# Altium project Hexapodik.PrjPcb
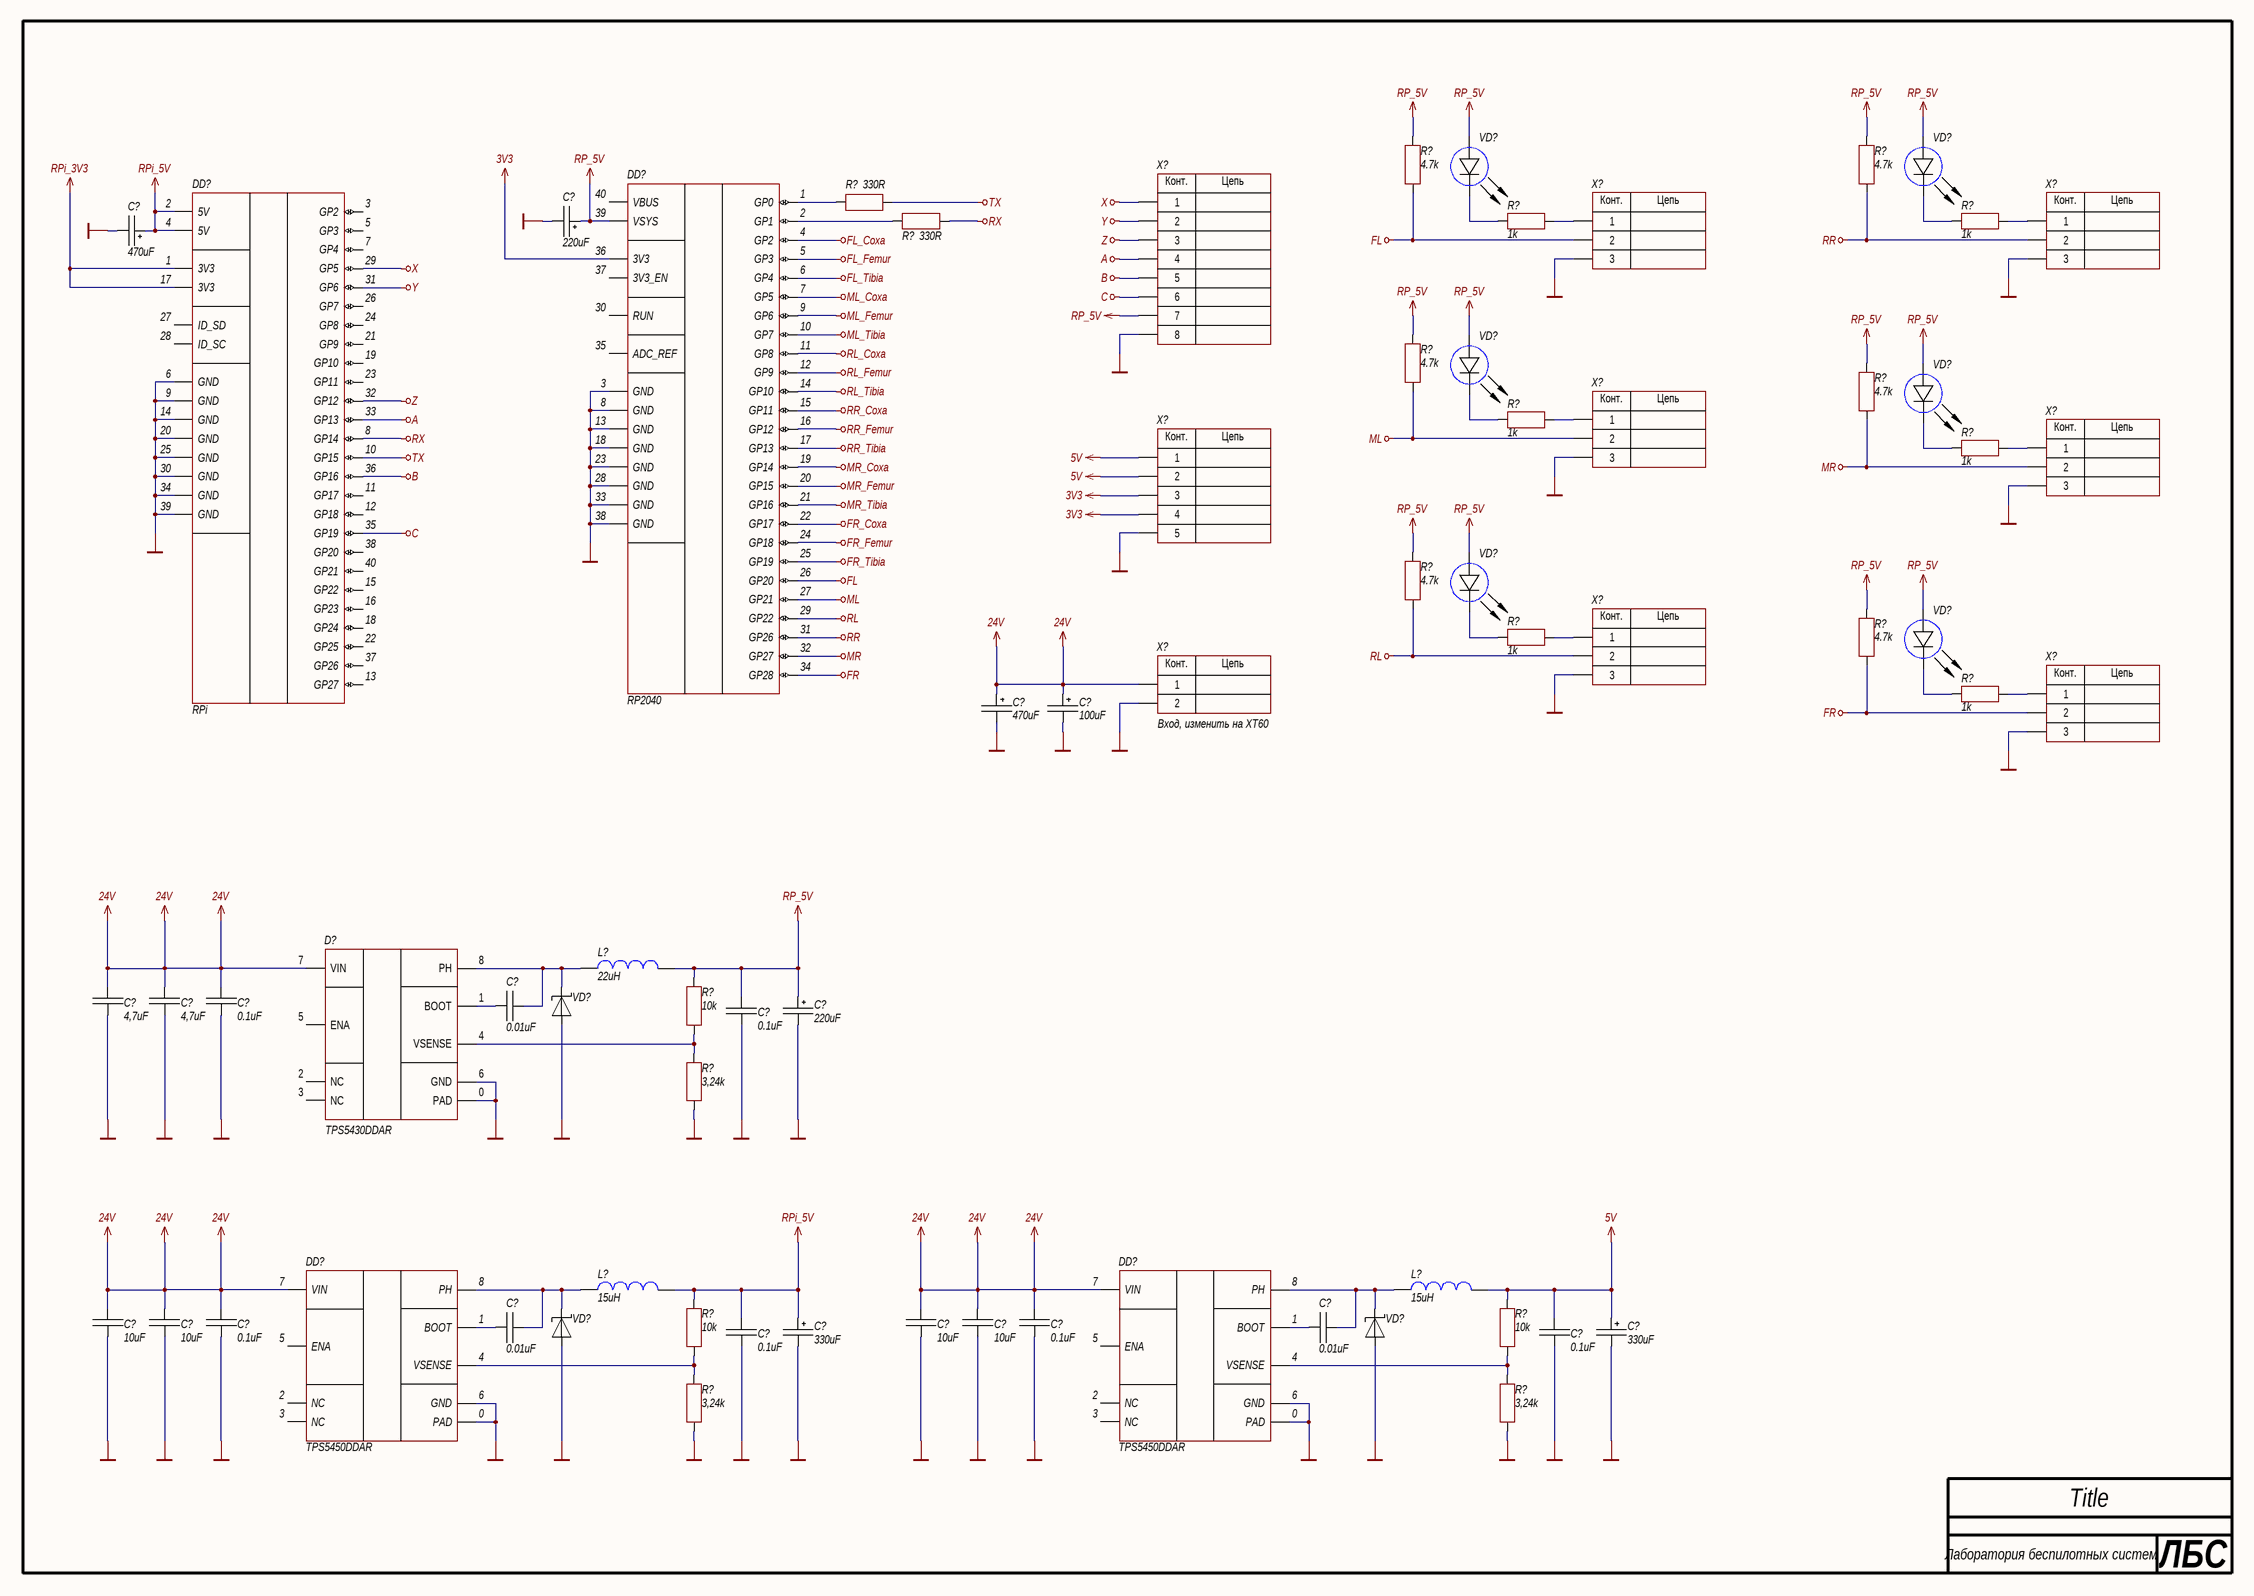
[diagram p0: Hexa.SchDoc]
2 sheets, 176 parts. Net scope: global (net labels, ports and power ports of the same name join across sheets).
Sheets:
  Hexa.SchDoc
  PowerLegs.SchDoc

## Sheet Hexa.SchDoc: Title
size 594 x 420 mm; CompanyName: Лаборатория беспилотных систем; Address1: Address1; Address2: Address2; Address3: Address3; Address4: Address4; DocumentNumber: АБВГ.123456.001 Э3; SheetNumber: 1; SheetTotal: 2; Scale: -; DocumentType: Схема электрическая принципиальная; FirstReferrence: АБВГ.123456.001

### Parts
(Parts that share a designator on the sheet are numbered #1, #2 ... from top to bottom, then left to right.)
C?#1  value 220uF  [CAP: SMD_L7.3-W4.3-H1.9]
C?#2  value 470uF  [CAP: SMD_L7.3-W4.3-H1.9]
C?#3  value 470uF  [CAP: SMD_L7.3-W4.3-H1.9]
C?#4  value 100uF  [CAP: SMD_L7.3-W4.3-H1.9]
C?#5  value 4,7uF  [CAP: 1206]
C?#6  value 4,7uF  [CAP: 1206]
C?#7  value 0.1uF  [CAP: 0603]
C?#8  value 220uF  [CAP: SMD_L7.3-W4.3-H1.9]
C?#9  value 0.01uF  [CAP: 0603]
C?#10  value 0.1uF  [CAP: 0603]
C?#11  value 10uF  [CAP: 1206]
C?#12  value 10uF  [CAP: 1206]
C?#13  value 0.1uF  [CAP: 0603]
C?#14  value 10uF  [CAP: 1206]
C?#15  value 10uF  [CAP: 1206]
C?#16  value 0.1uF  [CAP: 0603]
C?#17  value 330uF  [CAP: SMD_L7.3-W4.3-H1.9]
C?#18  value 330uF  [CAP: SMD_L7.3-W4.3-H1.9]
C?#19  value 0.01uF  [CAP: 0603]
C?#20  value 0.01uF  [CAP: 0603]
C?#21  value 0.1uF  [CAP: 0603]
C?#22  value 0.1uF  [CAP: 0603]
D?  (no value)  [8-SOIC-PAD]
DD?#1  RP2040
DD?#2  RPi
DD?#3  TPS5450DDAR
DD?#4  TPS5450DDAR
L?#1  value 22uH  [IND: SMD_L2.5-W2.0]
L?#2  value 15uH  [IND: SMD_L2.5-W2.0]
L?#3  value 15uH  [IND: SMD_L2.5-W2.0]
R?#1  value 4.7k  [RES: 0603]
R?#2  value 4.7k  [RES: 0603]
R?#3  value 330R  [RES: 0603]
R?#4  value 330R  [RES: 0603]
R?#5  value 1k  [RES: 0603]
R?#6  value 1k  [RES: 0603]
R?#7  value 4.7k  [RES: 0603]
R?#8  value 4.7k  [RES: 0603]
R?#9  value 1k  [RES: 0603]
R?#10  value 1k  [RES: 0603]
R?#11  value 4.7k  [RES: 0603]
R?#12  value 4.7k  [RES: 0603]
R?#13  value 1k  [RES: 0603]
R?#14  value 1k  [RES: 0603]
R?#15  value 10k  [RES: 0603]
R?#16  value 3,24k  [RES: 0603]
R?#17  value 10k  [RES: 0603]
R?#18  value 10k  [RES: 0603]
R?#19  value 3,24k  [RES: 0603]
R?#20  value 3,24k  [RES: 0603]
VD?#1  (no value)  [LED: 0402B]
VD?#2  (no value)  [LED: 0402B]
VD?#3  (no value)  [LED: 0402B]
VD?#4  (no value)  [LED: 0402B]
VD?#5  (no value)  [LED: 0402B]
VD?#6  (no value)  [LED: 0402B]
VD?#7  (no value)  [DIODE: SMA]
VD?#8  (no value)  [DIODE: SMA]
VD?#9  (no value)  [DIODE: SMA]
X?#1  (no value)  [CON: PLS-8]
X?#2  (no value)  [CON: PLS-3]
X?#3  (no value)  [CON: PLS-3]
X?#4  (no value)  [CON: PLS-3]
X?#5  (no value)  [CON: PLS-3]
X?#6  (no value)  [CON: PLS-5]
X?#7  (no value)  [CON: PLS-3]
X?#8  (no value)  [CON: PLS-2]
X?#9  (no value)  [CON: PLS-3]

### Nets
3V3: DD?#1.36(3V3) X?#6.3 X?#6.4
5V: C?#18.1 C?#22.1 L?#3.1 R?#18.2 X?#6.1 X?#6.2
24V: C?#3.1 C?#4.1 C?#5.2 C?#6.2 C?#7.2 C?#11.2 C?#12.2 C?#13.2 C?#14.2 C?#15.2 C?#16.2 D?.7(VIN) DD?#3.7(VIN) DD?#4.7(VIN) X?#8.1
A: DD?#2.33(GP13) X?#1.4
B: DD?#2.36(GP16) X?#1.5
C: DD?#2.35(GP19) X?#1.6
FL: DD?#1.26(GP20) R?#1.2 X?#2.2
FL_Coxa: DD?#1.4(GP2)
FL_Femur: DD?#1.5(GP3)
FL_Tibia: DD?#1.6(GP4)
FR: DD?#1.34(GP28) R?#12.2 X?#9.2
FR_Coxa: DD?#1.22(GP17)
FR_Femur: DD?#1.24(GP18)
FR_Tibia: DD?#1.25(GP19)
GND: C?#1.2 C?#2.2 C?#3.2 C?#4.2 C?#5.1 C?#6.1 C?#7.1 C?#8.2 C?#10.2 C?#11.1 C?#12.1 C?#13.1 C?#14.1 C?#15.1 C?#16.1 C?#17.2 C?#18.2 C?#21.2 C?#22.2 D?.0(PAD) D?.6(GND) DD?#1.3(GND) DD?#1.8(GND) DD?#1.13(GND) DD?#1.18(GND) DD?#1.23(GND) DD?#1.28(GND) DD?#1.33(GND) DD?#1.38(GND) DD?#2.6(GND) DD?#2.9(GND) DD?#2.14(GND) DD?#2.20(GND) DD?#2.25(GND) DD?#2.30(GND) DD?#2.34(GND) DD?#2.39(GND) DD?#3.0(PAD) DD?#3.6(GND) DD?#4.0(PAD) DD?#4.6(GND) R?#16.1 R?#19.1 R?#20.1 VD?#7.1 VD?#8.1 VD?#9.1 X?#1.8 X?#2.3 X?#3.3 X?#4.3 X?#5.3 X?#6.5 X?#7.3 X?#8.2 X?#9.3
ML: DD?#1.27(GP21) R?#7.2 X?#4.2
ML_Coxa: DD?#1.7(GP5)
ML_Femur: DD?#1.9(GP6)
ML_Tibia: DD?#1.10(GP7)
MR: DD?#1.32(GP27) R?#8.2 X?#5.2
MR_Coxa: DD?#1.19(GP14)
MR_Femur: DD?#1.20(GP15)
MR_Tibia: DD?#1.21(GP16)
RL: DD?#1.29(GP22) R?#11.2 X?#7.2
RL_Coxa: DD?#1.11(GP8)
RL_Femur: DD?#1.12(GP9)
RL_Tibia: DD?#1.14(GP10)
RP_5V: C?#1.1 C?#8.1 C?#10.1 DD?#1.39(VSYS) L?#1.1 R?#1.1 R?#2.1 R?#7.1 R?#8.1 R?#11.1 R?#12.1 R?#15.2 VD?#1.1(A) VD?#2.1(A) VD?#3.1(A) VD?#4.1(A) VD?#5.1(A) VD?#6.1(A) X?#1.7
RPi_3V3: DD?#2.1(3V3) DD?#2.17(3V3)
RPi_5V: C?#2.1 C?#17.1 C?#21.1 DD?#2.2(5V) DD?#2.4(5V) L?#2.1 R?#17.2
RR: DD?#1.31(GP26) R?#2.2 X?#3.2
RR_Coxa: DD?#1.15(GP11)
RR_Femur: DD?#1.16(GP12)
RR_Tibia: DD?#1.17(GP13)
RX: DD?#2.8(GP14) R?#4.2
TX: DD?#2.10(GP15) R?#3.2
X: DD?#2.29(GP5) X?#1.1
Y: DD?#2.31(GP6) X?#1.2
Z: DD?#2.32(GP12) X?#1.3
NetC?#9_1: C?#9.1 D?.8(PH) L?#1.2 VD?#7.2
NetC?#9_2: C?#9.2 D?.1(BOOT)
NetC?#19_1: C?#19.1 DD?#3.8(PH) L?#2.2 VD?#8.2
NetC?#19_2: C?#19.2 DD?#3.1(BOOT)
NetC?#20_1: C?#20.1 DD?#4.8(PH) L?#3.2 VD?#9.2
NetC?#20_2: C?#20.2 DD?#4.1(BOOT)
NetD?_4: D?.4(VSENSE) R?#15.1 R?#16.2
NetDD?#1_1: DD?#1.1(GP0) R?#3.1
NetDD?#1_2: DD?#1.2(GP1) R?#4.1
NetDD?#3_4: DD?#3.4(VSENSE) R?#17.1 R?#19.2
NetDD?#4_4: DD?#4.4(VSENSE) R?#18.1 R?#20.2
NetR?#5_1: R?#5.1 VD?#1.2(C)
NetR?#5_2: R?#5.2 X?#2.1
NetR?#6_1: R?#6.1 VD?#2.2(C)
NetR?#6_2: R?#6.2 X?#3.1
NetR?#9_1: R?#9.1 VD?#3.2(C)
NetR?#9_2: R?#9.2 X?#4.1
NetR?#10_1: R?#10.1 VD?#4.2(C)
NetR?#10_2: R?#10.2 X?#5.1
NetR?#13_1: R?#13.1 VD?#5.2(C)
NetR?#13_2: R?#13.2 X?#7.1
NetR?#14_1: R?#14.1 VD?#6.2(C)
NetR?#14_2: R?#14.2 X?#9.1

Not connected (* = marked no-connect by the designer): D? 2(NC) 3(NC) 5(ENA); DD?#1 30(RUN) 35(ADC_REF) 37(3V3_EN) 40(VBUS); DD?#2 3(GP2) 5(GP3) 7(GP4) 11(GP17) 12(GP18) 13(GP27) 15(GP22) 16(GP23) 18(GP24) 19(GP10) 21(GP9) 22(GP25) 23(GP11) 24(GP8) 26(GP7) 27(ID_SD) 28(ID_SC) 37(GP26) 38(GP20) 40(GP21); DD?#3 2(NC) 3(NC) 5(ENA); DD?#4 2(NC) 3(NC) 5(ENA)

### Notes on the sheet
- (near X?#8) Вход, изменить на XT60
- ЛБС
- (in symbol PLS-2) Конт.; Цепь
- (in symbol PLS-3) Конт.; Цепь
- (in symbol PLS-5) Конт.; Цепь
- (in symbol PLS-8) Конт.; Цепь

### Library data of the parts
C?#1 C?#8 = Polymer_7.3x4.3x1.9: Manufacturer: Ymin; PartNumber: MPD220M1VD19040R; ValueManufacturerPartNumber: Polymer Cap, 220uF, 35V, ±20%, 40mOhm@100kHz, SMD,7.3x4.3х1.9mm, -55...+125°C; Impedance: 40mOhm@100kHz; Tolerance: ±20%; TypeCapacitor: Polymer Cap; Voltage: 35V; Package: SMD,7.3x4.3х1.9mm; HelpURL: https://jlcpcb.com/partdetail/Ymin-MPD220M1VD19040R/C2997487; Temperature: -55...+125°C; TypeDielectric: Polymer; SupplierCode: C2997487
C?#2 C?#3 = Polymer_7.3x4.3x1.9: Manufacturer: Ymin; PartNumber: MPD220M1VD19040R; ValueManufacturerPartNumber: Polymer Cap, 470uF, 35V, ±20%, 40mOhm@100kHz, SMD,7.3x4.3х1.9mm, -55...+125°C; Impedance: 40mOhm@100kHz; Tolerance: ±20%; TypeCapacitor: Polymer Cap; Voltage: 35V; Package: SMD,7.3x4.3х1.9mm; HelpURL: https://jlcpcb.com/partdetail/Ymin-MPD220M1VD19040R/C2997487; Temperature: -55...+125°C; TypeDielectric: Polymer; SupplierCode: C2997487
C?#4 = Polymer_7.3x4.3x1.9: Manufacturer: Ymin; PartNumber: MPD220M1VD19040R; ValueManufacturerPartNumber: Polymer Cap, 100uF, 35V, ±20%, 40mOhm@100kHz, SMD,7.3x4.3х1.9mm, -55...+125°C; Impedance: 40mOhm@100kHz; Tolerance: ±20%; TypeCapacitor: Polymer Cap; Voltage: 35V; Package: SMD,7.3x4.3х1.9mm; HelpURL: https://jlcpcb.com/partdetail/Ymin-MPD220M1VD19040R/C2997487; Temperature: -55...+125°C; TypeDielectric: Polymer; SupplierCode: C2997487
C?#5 C?#6 = Ceramic_1206: Manufacturer: Yageo; PartNumber: CC1206KRX7R9BB104; ValueManufacturerPartNumber: Ceramic capacitor, 4,7uF, X7R, ±10%, 50V, 1206, -55...+125°C; TypeCapacitor: Ceramic capacitor; Tolerance: ±10%; TypeDielectric: X7R; Voltage: 50V; Package: 1206; HelpURL: https://www.digikey.com/product-detail/en/yageo/CC1206KRX7R9BB104/311-1179-1-ND/303089; Temperature: -55...+125°C
C?#7 C?#10 C?#13 C?#16 C?#21 C?#22 = Ceramic_0603: Manufacturer: Yageo; PartNumber: CC0603KRX7R7BB104; ValueManufacturerPartNumber: Ceramic capacitor, 0.1uF, X7R, ±10%, 16V, 0603, -55...+125°C; TypeCapacitor: Ceramic capacitor; Tolerance: ±10%; TypeDielectric: X7R; Voltage: 16V; Package: 0603; HelpURL: https://www.digikey.com/product-detail/en/yageo/CC0603KRX7R7BB104/311-1088-1-ND/302998; Temperature: -55...+125°C
C?#9 C?#19 C?#20 = Ceramic_0603: Manufacturer: Yageo; PartNumber: CC0603KRX7R7BB104; ValueManufacturerPartNumber: Ceramic capacitor, 0.01uF, X7R, ±10%, 16V, 0603, -55...+125°C; TypeCapacitor: Ceramic capacitor; Tolerance: ±10%; TypeDielectric: X7R; Voltage: 16V; Package: 0603; HelpURL: https://www.digikey.com/product-detail/en/yageo/CC0603KRX7R7BB104/311-1088-1-ND/302998; Temperature: -55...+125°C
C?#11 C?#12 C?#14 C?#15 = Ceramic_1206: Manufacturer: Yageo; PartNumber: CC1206KRX7R9BB104; ValueManufacturerPartNumber: Ceramic capacitor, 10uF, X7R, ±10%, 50V, 1206, -55...+125°C; TypeCapacitor: Ceramic capacitor; Tolerance: ±10%; TypeDielectric: X7R; Voltage: 50V; Package: 1206; HelpURL: https://www.digikey.com/product-detail/en/yageo/CC1206KRX7R9BB104/311-1179-1-ND/303089; Temperature: -55...+125°C
C?#17 C?#18 = Polymer_7.3x4.3x1.9: Manufacturer: Ymin; PartNumber: MPD220M1VD19040R; ValueManufacturerPartNumber: Polymer Cap, 330uF, 35V, ±20%, 40mOhm@100kHz, SMD,7.3x4.3х1.9mm, -55...+125°C; Impedance: 40mOhm@100kHz; Tolerance: ±20%; TypeCapacitor: Polymer Cap; Voltage: 35V; Package: SMD,7.3x4.3х1.9mm; HelpURL: https://jlcpcb.com/partdetail/Ymin-MPD220M1VD19040R/C2997487; Temperature: -55...+125°C; TypeDielectric: Polymer; SupplierCode: C2997487
D? = TPS5430DDAR: Buck converter; Manufacturer: Texas Intruments; ValueManufacturerPartNumber: DC/DC buck converter, input 4.5...36V, 500KHz, 1.221V-32.04V, 3A, -40...+125°C, 8-SOIC; VoltageInput: input 4.5...36V; Frequency: 500KHz; CurrentOutput: 3A; VoltageOutput: 1.221V-32.04V; HelpURL: https://jlcpcb.com/partdetail/TexasInstruments-TPS5430DDAR/C9864; Package: 8-SOIC; ComponentType: DC/DC buck converter; Temperature: -40...+125°C; SupplierCode: *; PartNumber: TPS5430DDAR
L?#1-L?#3 = Inductor_FTC252010S220MBCA: Manufacturer: Sunlord; TypeInductor: Fixed inductor; MaxCurrent: 1.1A; Tolerance: ±20%; PartNumber: FTC252010S220MBCA; Package: SMD,2x2.5mm; HelpURL: https://jlcpcb.com/partdetail/6763511-FTC252010S220MBCA/C5832391; ValueManufacturerPartNumber: =TypeInductor+', '+Value+', '+Tolerance+', '+Package+', '+MaxCurrent+', '+Temperature; SupplierCode: C5832391
R?#1 R?#2 R?#7 R?#8 R?#11 R?#12 = Resistor_0603: Manufacturer: Yageo; PartNumber: RC0603JR-07100RL; ValueManufacturerPartNumber: Resistor film, 4.7k, ±5%, 0603, 0.1W, -55...+125°C; TypeResistor: Resistor film; Power: 0.1W; Tolerance: ±5%; Package: 0603; HelpURL: https://www.digikey.com/product-detail/en/yageo/RC0603JR-07100RL/311-100GRCT-ND/729644; Temperature: -55...+125°C
R?#3 R?#4 = Resistor_0603: Manufacturer: Yageo; PartNumber: RC0603JR-07100RL; ValueManufacturerPartNumber: Resistor film, 330R, ±5%, 0603, 0.1W, -55...+125°C; TypeResistor: Resistor film; Power: 0.1W; Tolerance: ±5%; Package: 0603; HelpURL: https://www.digikey.com/product-detail/en/yageo/RC0603JR-07100RL/311-100GRCT-ND/729644; Temperature: -55...+125°C
R?#5 R?#6 R?#9 R?#10 R?#13 R?#14 = Resistor_0603: Manufacturer: Yageo; PartNumber: RC0603JR-07100RL; ValueManufacturerPartNumber: Resistor film, 1k, ±5%, 0603, 0.1W, -55...+125°C; TypeResistor: Resistor film; Power: 0.1W; Tolerance: ±5%; Package: 0603; HelpURL: https://www.digikey.com/product-detail/en/yageo/RC0603JR-07100RL/311-100GRCT-ND/729644; Temperature: -55...+125°C
R?#15 R?#17 R?#18 = Resistor_0603: Manufacturer: Yageo; PartNumber: RC0603JR-07100RL; ValueManufacturerPartNumber: Resistor film, 10k, ±5%, 0603, 0.1W, -55...+125°C; TypeResistor: Resistor film; Power: 0.1W; Tolerance: ±5%; Package: 0603; HelpURL: https://www.digikey.com/product-detail/en/yageo/RC0603JR-07100RL/311-100GRCT-ND/729644; Temperature: -55...+125°C
R?#16 R?#19 R?#20 = Resistor_0603: Manufacturer: Yageo; PartNumber: RC0603JR-07100RL; ValueManufacturerPartNumber: Resistor film, 3,24k, ±5%, 0603, 0.1W, -55...+125°C; TypeResistor: Resistor film; Power: 0.1W; Tolerance: ±5%; Package: 0603; HelpURL: https://www.digikey.com/product-detail/en/yageo/RC0603JR-07100RL/311-100GRCT-ND/729644; Temperature: -55...+125°C
VD?#1-VD?#6 = LED_single: ValueManufacturerPartNumber: LED, Green, *, *, *, -55...+150°C; TypeDiode: LED; ColorParameter: Green; Manufacturer: *; Package: *; HelpURL: *; Temperature: -55...+150°C; Current: *; VoltageDrop: *; PartNumber: *; Color: GREEN
VD?#7-VD?#9 = Schottky_single: Manufacturer: Diodes Incorporated; ValueManufacturerPartNumber: Schottky diode, 80V, 500mA, 1V, 15pF, SOD-123, -55...+150°C; PartNumber: MBR0580S1-7; TypeDiode: Schottky diode; Voltage: 80V; Current: 500mA; VoltageDrop: 1V; RecoveryTime: 15pF; Package: SOD-123; HelpURL: https://www.digikey.com/product-detail/en/diodes-incorporated/MBR0580S1-7/MBR0580S1-7DICT-ND/5080371; Temperature: -55...+150°C
X?#1 = PLS-8: Manufacturer: Connfly; ValueManufacturerPartNumber: Connector, 8pin, 2.54mm, 500VAC, 3A; TypeConnector: Connector; Voltage: 500VAC; Pitch: 2.54mm; Current: 3A; Multichannel: 8pin; HelpURL: https://www.chipdip.ru/product/pls-8-ds1021-1-8sf112; PartNumber: PLS-8
X?#2-X?#5 X?#7 X?#9 = PLS-3: Manufacturer: Connfly; ValueManufacturerPartNumber: Connector, 3pin, 2.54mm, 500VAC, 3A; TypeConnector: Connector; Voltage: 500VAC; Pitch: 2.54mm; Current: 3A; Multichannel: 3pin; HelpURL: https://www.chipdip.ru/product/pls-3; PartNumber: PLS-3
X?#6 = PLS-5: Manufacturer: Connfly; ValueManufacturerPartNumber: Connector, 5pin, 2.54mm, 500VAC, 3A; TypeConnector: Connector; Voltage: 500VAC; Pitch: 2.54mm; Current: 3A; Multichannel: 5pin; HelpURL: https://www.chipdip.ru/product/pls-5; PartNumber: PLS-5
X?#8 = PLS-2: Manufacturer: Connfly; ValueManufacturerPartNumber: Connector, 2pin, 2.54mm, 500VAC, 3A; TypeConnector: Connector; Voltage: 500VAC; Pitch: 2.54mm; Current: 3A; Multichannel: 2pin; HelpURL: https://www.chipdip.ru/product/pls-2; PartNumber: PLS-2

## Sheet PowerLegs.SchDoc: Title
size 594 x 420 mm; CompanyName: Лаборатория беспилотных систем; Address1: Address1; Address2: Address2; Address3: Address3; Address4: Address4; DocumentNumber: АБВГ.123456.001 Э3; SheetNumber: 2; SheetTotal: 2; Scale: -; DocumentType: Схема электрическая принципиальная; FirstReferrence: АБВГ.123456.001
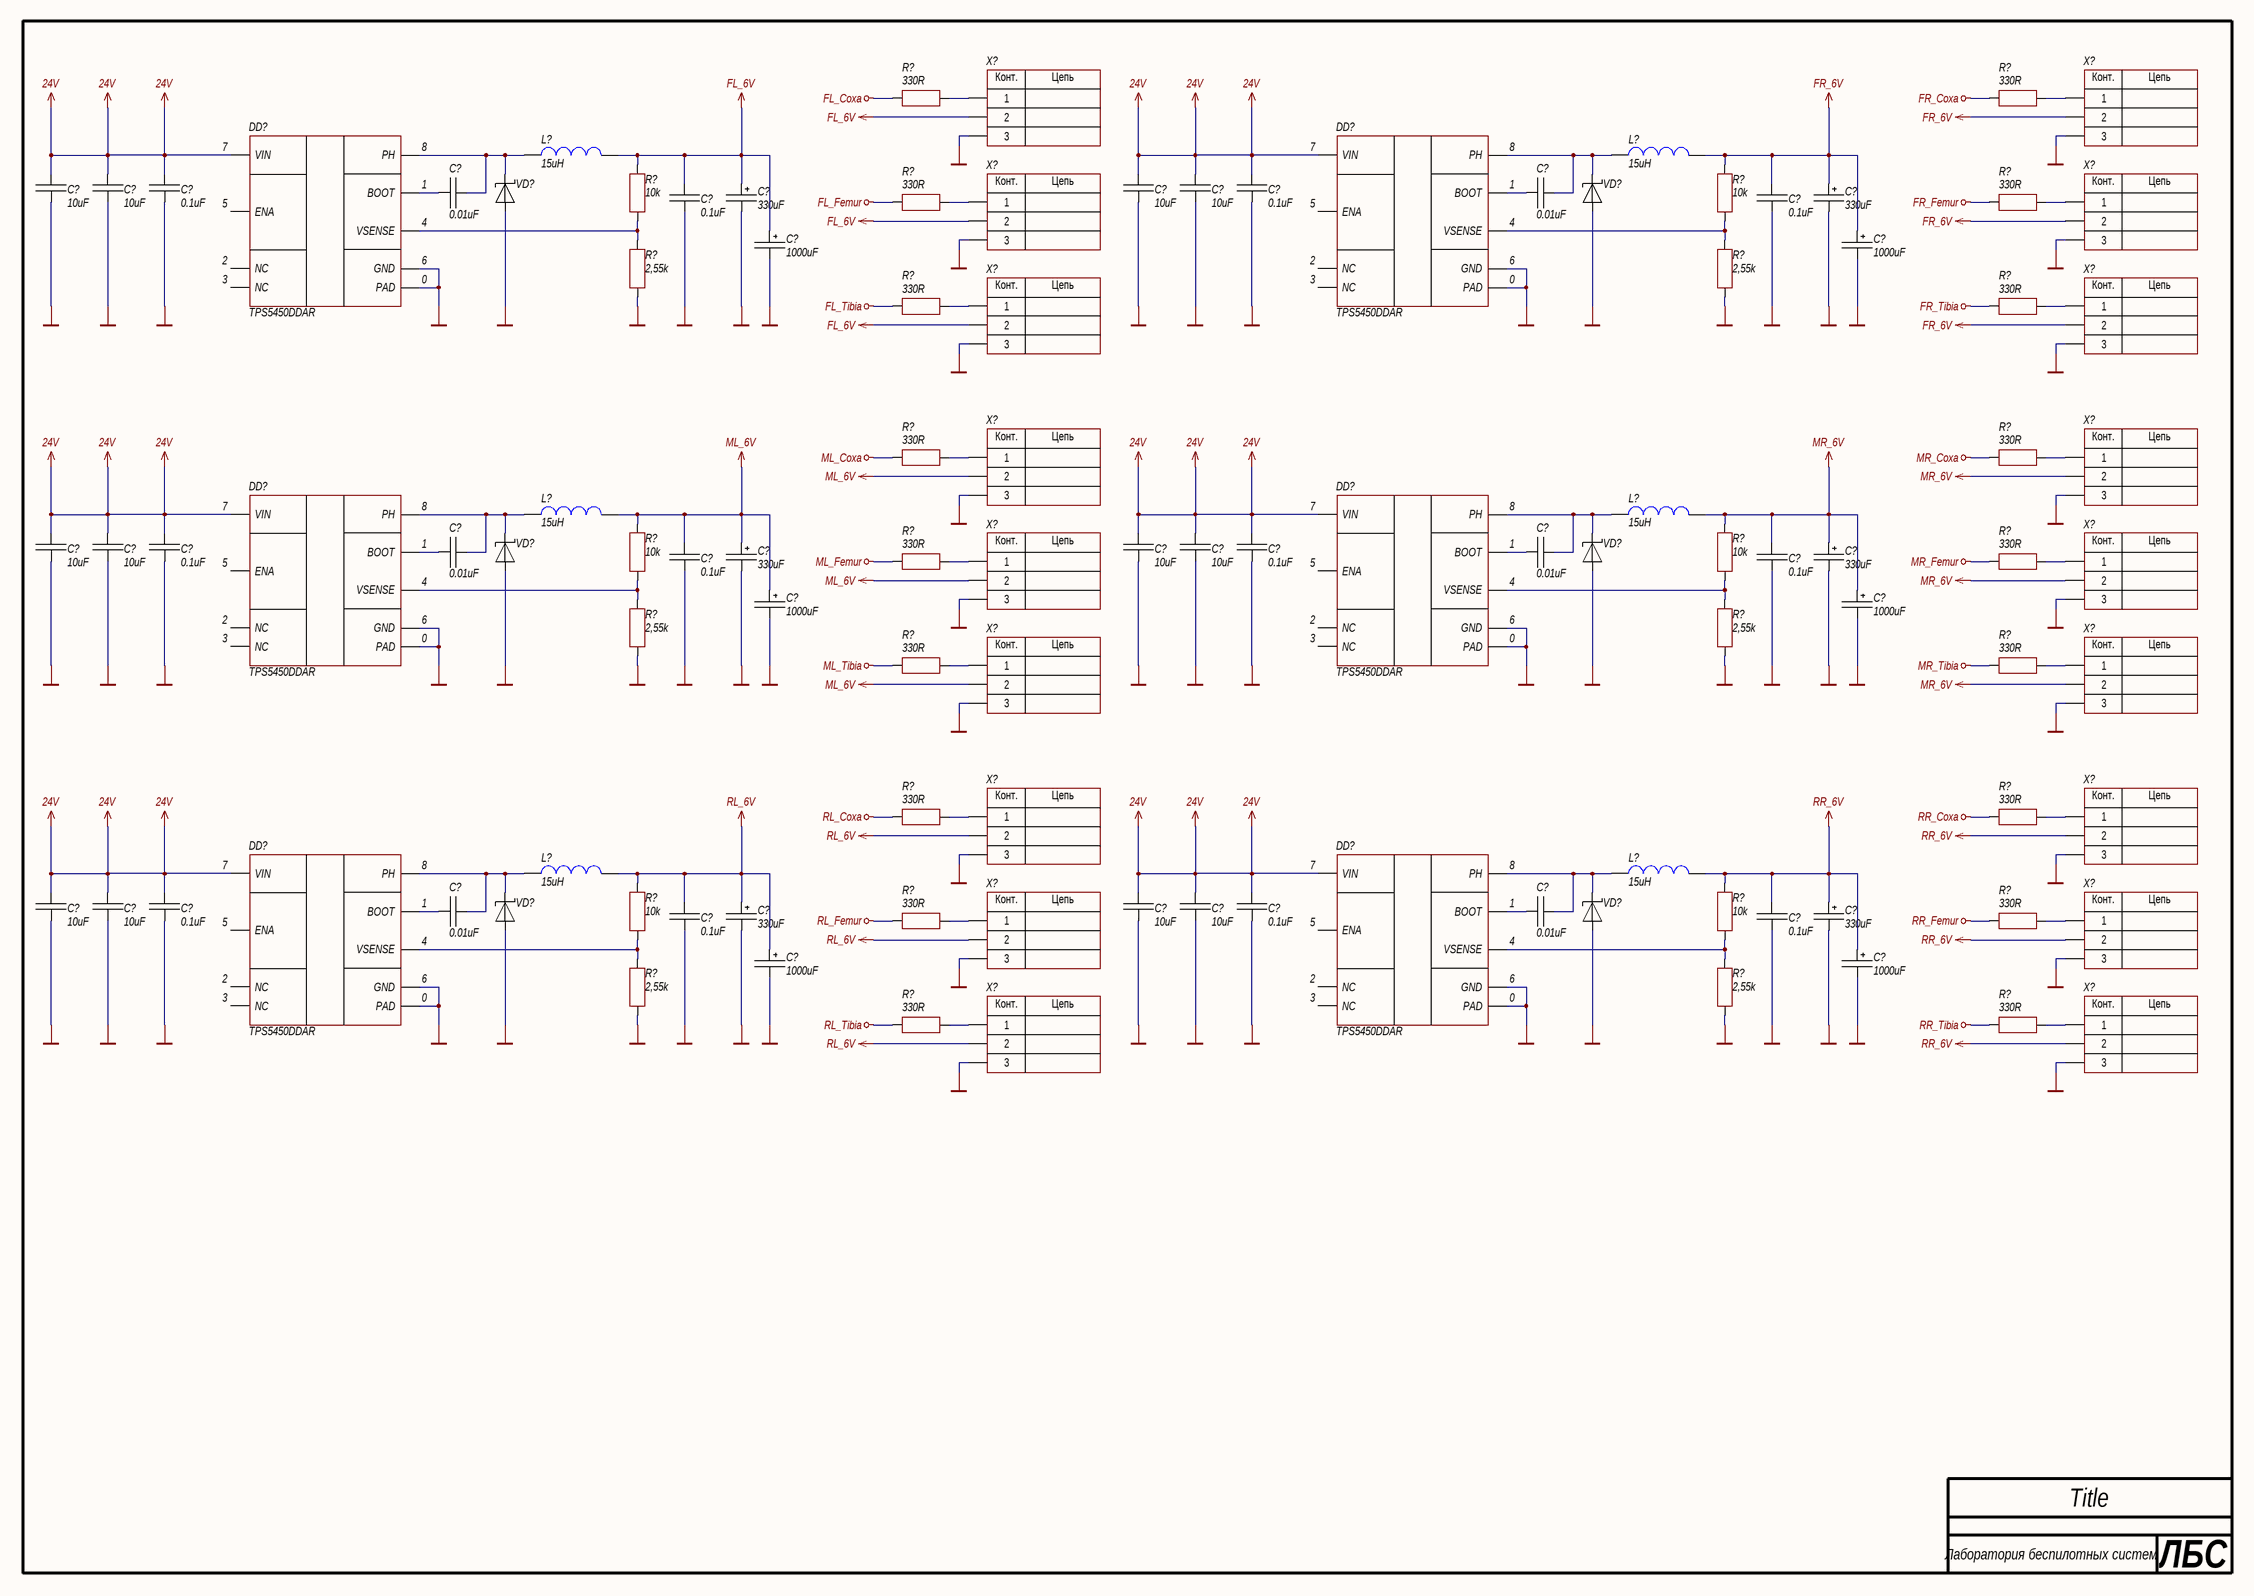
[diagram p1: PowerLegs.SchDoc]

### Parts
(Parts that share a designator on the sheet are numbered #1, #2 ... from top to bottom, then left to right.)
C?#23  value 10uF  [CAP: 1206]
C?#24  value 10uF  [CAP: 1206]
C?#25  value 0.1uF  [CAP: 0603]
C?#26  value 10uF  [CAP: 1206]
C?#27  value 10uF  [CAP: 1206]
C?#28  value 0.1uF  [CAP: 0603]
C?#29  value 330uF  [CAP: SMD_L7.3-W4.3-H1.9]
C?#30  value 330uF  [CAP: SMD_L7.3-W4.3-H1.9]
C?#31  value 0.01uF  [CAP: 0603]
C?#32  value 0.01uF  [CAP: 0603]
C?#33  value 0.1uF  [CAP: 0603]
C?#34  value 0.1uF  [CAP: 0603]
C?#35  value 1000uF  [CAP: SMD_L7.3-W4.3-H1.9]
C?#36  value 1000uF  [CAP: SMD_L7.3-W4.3-H1.9]
C?#37  value 10uF  [CAP: 1206]
C?#38  value 10uF  [CAP: 1206]
C?#39  value 0.1uF  [CAP: 0603]
C?#40  value 10uF  [CAP: 1206]
C?#41  value 10uF  [CAP: 1206]
C?#42  value 0.1uF  [CAP: 0603]
C?#43  value 330uF  [CAP: SMD_L7.3-W4.3-H1.9]
C?#44  value 330uF  [CAP: SMD_L7.3-W4.3-H1.9]
C?#45  value 0.01uF  [CAP: 0603]
C?#46  value 0.01uF  [CAP: 0603]
C?#47  value 0.1uF  [CAP: 0603]
C?#48  value 0.1uF  [CAP: 0603]
C?#49  value 1000uF  [CAP: SMD_L7.3-W4.3-H1.9]
C?#50  value 1000uF  [CAP: SMD_L7.3-W4.3-H1.9]
C?#51  value 10uF  [CAP: 1206]
C?#52  value 10uF  [CAP: 1206]
C?#53  value 0.1uF  [CAP: 0603]
C?#54  value 10uF  [CAP: 1206]
C?#55  value 10uF  [CAP: 1206]
C?#56  value 0.1uF  [CAP: 0603]
C?#57  value 330uF  [CAP: SMD_L7.3-W4.3-H1.9]
C?#58  value 330uF  [CAP: SMD_L7.3-W4.3-H1.9]
C?#59  value 0.01uF  [CAP: 0603]
C?#60  value 0.01uF  [CAP: 0603]
C?#61  value 0.1uF  [CAP: 0603]
C?#62  value 0.1uF  [CAP: 0603]
C?#63  value 1000uF  [CAP: SMD_L7.3-W4.3-H1.9]
C?#64  value 1000uF  [CAP: SMD_L7.3-W4.3-H1.9]
DD?#5  TPS5450DDAR
DD?#6  TPS5450DDAR
DD?#7  TPS5450DDAR
DD?#8  TPS5450DDAR
DD?#9  TPS5450DDAR
DD?#10  TPS5450DDAR
L?#4  value 15uH  [IND: SMD_L2.5-W2.0]
L?#5  value 15uH  [IND: SMD_L2.5-W2.0]
L?#6  value 15uH  [IND: SMD_L2.5-W2.0]
L?#7  value 15uH  [IND: SMD_L2.5-W2.0]
L?#8  value 15uH  [IND: SMD_L2.5-W2.0]
L?#9  value 15uH  [IND: SMD_L2.5-W2.0]
R?#21  value 330R  [RES: 0603]
R?#22  value 330R  [RES: 0603]
R?#23  value 330R  [RES: 0603]
R?#24  value 330R  [RES: 0603]
R?#25  value 10k  [RES: 0603]
R?#26  value 10k  [RES: 0603]
R?#27  value 2,55k  [RES: 0603]
R?#28  value 2,55k  [RES: 0603]
R?#29  value 330R  [RES: 0603]
R?#30  value 330R  [RES: 0603]
R?#31  value 330R  [RES: 0603]
R?#32  value 330R  [RES: 0603]
R?#33  value 330R  [RES: 0603]
R?#34  value 330R  [RES: 0603]
R?#35  value 10k  [RES: 0603]
R?#36  value 10k  [RES: 0603]
R?#37  value 2,55k  [RES: 0603]
R?#38  value 2,55k  [RES: 0603]
R?#39  value 330R  [RES: 0603]
R?#40  value 330R  [RES: 0603]
R?#41  value 330R  [RES: 0603]
R?#42  value 330R  [RES: 0603]
R?#43  value 330R  [RES: 0603]
R?#44  value 330R  [RES: 0603]
R?#45  value 10k  [RES: 0603]
R?#46  value 10k  [RES: 0603]
R?#47  value 2,55k  [RES: 0603]
R?#48  value 2,55k  [RES: 0603]
R?#49  value 330R  [RES: 0603]
R?#50  value 330R  [RES: 0603]
VD?#10  (no value)  [DIODE: SMA]
VD?#11  (no value)  [DIODE: SMA]
VD?#12  (no value)  [DIODE: SMA]
VD?#13  (no value)  [DIODE: SMA]
VD?#14  (no value)  [DIODE: SMA]
VD?#15  (no value)  [DIODE: SMA]
X?#10  (no value)  [CON: PLS-3]
X?#11  (no value)  [CON: PLS-3]
X?#12  (no value)  [CON: PLS-3]
X?#13  (no value)  [CON: PLS-3]
X?#14  (no value)  [CON: PLS-3]
X?#15  (no value)  [CON: PLS-3]
X?#16  (no value)  [CON: PLS-3]
X?#17  (no value)  [CON: PLS-3]
X?#18  (no value)  [CON: PLS-3]
X?#19  (no value)  [CON: PLS-3]
X?#20  (no value)  [CON: PLS-3]
X?#21  (no value)  [CON: PLS-3]
X?#22  (no value)  [CON: PLS-3]
X?#23  (no value)  [CON: PLS-3]
X?#24  (no value)  [CON: PLS-3]
X?#25  (no value)  [CON: PLS-3]
X?#26  (no value)  [CON: PLS-3]
X?#27  (no value)  [CON: PLS-3]

### Nets
24V: C?#23.2 C?#24.2 C?#25.2 C?#26.2 C?#27.2 C?#28.2 C?#37.2 C?#38.2 C?#39.2 C?#40.2 C?#41.2 C?#42.2 C?#51.2 C?#52.2 C?#53.2 C?#54.2 C?#55.2 C?#56.2 DD?#5.7(VIN) DD?#6.7(VIN) DD?#7.7(VIN) DD?#8.7(VIN) DD?#9.7(VIN) DD?#10.7(VIN)
FL_6V: C?#29.1 C?#33.1 C?#35.1 L?#4.1 R?#25.2 X?#10.2 X?#12.2 X?#14.2
FL_Coxa: R?#21.1
FL_Femur: R?#23.1
FL_Tibia: R?#29.1
FR_6V: C?#30.1 C?#34.1 C?#36.1 L?#5.1 R?#26.2 X?#11.2 X?#13.2 X?#15.2
FR_Coxa: R?#22.1
FR_Femur: R?#24.1
FR_Tibia: R?#30.1
GND: C?#23.1 C?#24.1 C?#25.1 C?#26.1 C?#27.1 C?#28.1 C?#29.2 C?#30.2 C?#33.2 C?#34.2 C?#35.2 C?#36.2 C?#37.1 C?#38.1 C?#39.1 C?#40.1 C?#41.1 C?#42.1 C?#43.2 C?#44.2 C?#47.2 C?#48.2 C?#49.2 C?#50.2 C?#51.1 C?#52.1 C?#53.1 C?#54.1 C?#55.1 C?#56.1 C?#57.2 C?#58.2 C?#61.2 C?#62.2 C?#63.2 C?#64.2 DD?#5.0(PAD) DD?#5.6(GND) DD?#6.0(PAD) DD?#6.6(GND) DD?#7.0(PAD) DD?#7.6(GND) DD?#8.0(PAD) DD?#8.6(GND) DD?#9.0(PAD) DD?#9.6(GND) DD?#10.0(PAD) DD?#10.6(GND) R?#27.1 R?#28.1 R?#37.1 R?#38.1 R?#47.1 R?#48.1 VD?#10.1 VD?#11.1 VD?#12.1 VD?#13.1 VD?#14.1 VD?#15.1 X?#10.3 X?#11.3 X?#12.3 X?#13.3 X?#14.3 X?#15.3 X?#16.3 X?#17.3 X?#18.3 X?#19.3 X?#20.3 X?#21.3 X?#22.3 X?#23.3 X?#24.3 X?#25.3 X?#26.3 X?#27.3
ML_6V: C?#43.1 C?#47.1 C?#49.1 L?#6.1 R?#35.2 X?#16.2 X?#18.2 X?#20.2
ML_Coxa: R?#31.1
ML_Femur: R?#33.1
ML_Tibia: R?#39.1
MR_6V: C?#44.1 C?#48.1 C?#50.1 L?#7.1 R?#36.2 X?#17.2 X?#19.2 X?#21.2
MR_Coxa: R?#32.1
MR_Femur: R?#34.1
MR_Tibia: R?#40.1
RL_6V: C?#57.1 C?#61.1 C?#63.1 L?#8.1 R?#45.2 X?#22.2 X?#24.2 X?#26.2
RL_Coxa: R?#41.1
RL_Femur: R?#43.1
RL_Tibia: R?#49.1
RR_6V: C?#58.1 C?#62.1 C?#64.1 L?#9.1 R?#46.2 X?#23.2 X?#25.2 X?#27.2
RR_Coxa: R?#42.1
RR_Femur: R?#44.1
RR_Tibia: R?#50.1
NetC?#31_1: C?#31.1 DD?#5.8(PH) L?#4.2 VD?#10.2
NetC?#31_2: C?#31.2 DD?#5.1(BOOT)
NetC?#32_1: C?#32.1 DD?#6.8(PH) L?#5.2 VD?#11.2
NetC?#32_2: C?#32.2 DD?#6.1(BOOT)
NetC?#45_1: C?#45.1 DD?#7.8(PH) L?#6.2 VD?#12.2
NetC?#45_2: C?#45.2 DD?#7.1(BOOT)
NetC?#46_1: C?#46.1 DD?#8.8(PH) L?#7.2 VD?#13.2
NetC?#46_2: C?#46.2 DD?#8.1(BOOT)
NetC?#59_1: C?#59.1 DD?#9.8(PH) L?#8.2 VD?#14.2
NetC?#59_2: C?#59.2 DD?#9.1(BOOT)
NetC?#60_1: C?#60.1 DD?#10.8(PH) L?#9.2 VD?#15.2
NetC?#60_2: C?#60.2 DD?#10.1(BOOT)
NetDD?#5_4: DD?#5.4(VSENSE) R?#25.1 R?#27.2
NetDD?#6_4: DD?#6.4(VSENSE) R?#26.1 R?#28.2
NetDD?#7_4: DD?#7.4(VSENSE) R?#35.1 R?#37.2
NetDD?#8_4: DD?#8.4(VSENSE) R?#36.1 R?#38.2
NetDD?#9_4: DD?#9.4(VSENSE) R?#45.1 R?#47.2
NetDD?#10_4: DD?#10.4(VSENSE) R?#46.1 R?#48.2
NetR?#21_2: R?#21.2 X?#10.1
NetR?#22_2: R?#22.2 X?#11.1
NetR?#23_2: R?#23.2 X?#12.1
NetR?#24_2: R?#24.2 X?#13.1
NetR?#29_2: R?#29.2 X?#14.1
NetR?#30_2: R?#30.2 X?#15.1
NetR?#31_2: R?#31.2 X?#16.1
NetR?#32_2: R?#32.2 X?#17.1
NetR?#33_2: R?#33.2 X?#18.1
NetR?#34_2: R?#34.2 X?#19.1
NetR?#39_2: R?#39.2 X?#20.1
NetR?#40_2: R?#40.2 X?#21.1
NetR?#41_2: R?#41.2 X?#22.1
NetR?#42_2: R?#42.2 X?#23.1
NetR?#43_2: R?#43.2 X?#24.1
NetR?#44_2: R?#44.2 X?#25.1
NetR?#49_2: R?#49.2 X?#26.1
NetR?#50_2: R?#50.2 X?#27.1

Not connected (* = marked no-connect by the designer): DD?#5 2(NC) 3(NC) 5(ENA); DD?#6 2(NC) 3(NC) 5(ENA); DD?#7 2(NC) 3(NC) 5(ENA); DD?#8 2(NC) 3(NC) 5(ENA); DD?#9 2(NC) 3(NC) 5(ENA); DD?#10 2(NC) 3(NC) 5(ENA)

### Notes on the sheet
- ЛБС
- (in symbol PLS-3) Конт.; Цепь

### Library data of the parts
C?#23 C?#24 C?#26 C?#27 C?#37 C?#38 C?#40 C?#41 C?#51 C?#52 C?#54 C?#55 = Ceramic_1206: as C?#11 on sheet Hexa; Package: 1206; HelpURL: https://www.digikey.com/product-detail/en/yageo/CC1206KRX7R9BB104/311-1179-1-ND/303089; Temperature: -55...+125°C
C?#25 C?#28 C?#33 C?#34 C?#39 C?#42 C?#47 C?#48 C?#53 C?#56 C?#61 C?#62 = Ceramic_0603: as C?#7 on sheet Hexa; Package: 0603; HelpURL: https://www.digikey.com/product-detail/en/yageo/CC0603KRX7R7BB104/311-1088-1-ND/302998; Temperature: -55...+125°C
C?#29 C?#30 C?#43 C?#44 C?#57 C?#58 = Polymer_7.3x4.3x1.9: as C?#17 on sheet Hexa; Package: SMD,7.3x4.3х1.9mm; HelpURL: https://jlcpcb.com/partdetail/Ymin-MPD220M1VD19040R/C2997487; Temperature: -55...+125°C; TypeDielectric: Polymer; SupplierCode: C2997487
C?#31 C?#32 C?#45 C?#46 C?#59 C?#60 = Ceramic_0603: as C?#9 on sheet Hexa; Package: 0603; HelpURL: https://www.digikey.com/product-detail/en/yageo/CC0603KRX7R7BB104/311-1088-1-ND/302998; Temperature: -55...+125°C
C?#35 C?#36 C?#49 C?#50 C?#63 C?#64 = Polymer_7.3x4.3x1.9: Manufacturer: Ymin; PartNumber: MPD220M1VD19040R; ValueManufacturerPartNumber: Polymer Cap, 1000uF, 35V, ±20%, 40mOhm@100kHz, SMD,7.3x4.3х1.9mm, -55...+125°C; Impedance: 40mOhm@100kHz; Tolerance: ±20%; TypeCapacitor: Polymer Cap; Voltage: 35V; Package: SMD,7.3x4.3х1.9mm; HelpURL: https://jlcpcb.com/partdetail/Ymin-MPD220M1VD19040R/C2997487; Temperature: -55...+125°C; TypeDielectric: Polymer; SupplierCode: C2997487
L?#4-L?#9 = Inductor_FTC252010S220MBCA: as L?#1 on sheet Hexa; PartNumber: FTC252010S220MBCA; Package: SMD,2x2.5mm; HelpURL: https://jlcpcb.com/partdetail/6763511-FTC252010S220MBCA/C5832391; ValueManufacturerPartNumber: =TypeInductor+', '+Value+', '+Tolerance+', '+Package+', '+MaxCurrent+', '+Temperature; SupplierCode: C5832391
R?#21-R?#24 R?#29-R?#34 R?#39-R?#44 R?#49 R?#50 = Resistor_0603: as R?#3 on sheet Hexa; Package: 0603; HelpURL: https://www.digikey.com/product-detail/en/yageo/RC0603JR-07100RL/311-100GRCT-ND/729644; Temperature: -55...+125°C
R?#25 R?#26 R?#35 R?#36 R?#45 R?#46 = Resistor_0603: as R?#15 on sheet Hexa; Package: 0603; HelpURL: https://www.digikey.com/product-detail/en/yageo/RC0603JR-07100RL/311-100GRCT-ND/729644; Temperature: -55...+125°C
R?#27 R?#28 R?#37 R?#38 R?#47 R?#48 = Resistor_0603: Manufacturer: Yageo; PartNumber: RC0603JR-07100RL; ValueManufacturerPartNumber: Resistor film, 2,55k, ±5%, 0603, 0.1W, -55...+125°C; TypeResistor: Resistor film; Power: 0.1W; Tolerance: ±5%; Package: 0603; HelpURL: https://www.digikey.com/product-detail/en/yageo/RC0603JR-07100RL/311-100GRCT-ND/729644; Temperature: -55...+125°C
VD?#10-VD?#15 = Schottky_single: as VD?#7 on sheet Hexa; Package: SOD-123; HelpURL: https://www.digikey.com/product-detail/en/diodes-incorporated/MBR0580S1-7/MBR0580S1-7DICT-ND/5080371; Temperature: -55...+150°C
X?#10-X?#27 = PLS-3: as X?#2 on sheet Hexa; HelpURL: https://www.chipdip.ru/product/pls-3; PartNumber: PLS-3

## Nets that join several sheets
24V: Hexa (15 pins), PowerLegs (24 pins)
FL_Coxa: Hexa (DD?#1.4), PowerLegs (R?#21.1)
FL_Femur: Hexa (DD?#1.5), PowerLegs (R?#23.1)
FL_Tibia: Hexa (DD?#1.6), PowerLegs (R?#29.1)
FR_Coxa: Hexa (DD?#1.22), PowerLegs (R?#22.1)
FR_Femur: Hexa (DD?#1.24), PowerLegs (R?#24.1)
FR_Tibia: Hexa (DD?#1.25), PowerLegs (R?#30.1)
GND: Hexa (56 pins), PowerLegs (78 pins)
ML_Coxa: Hexa (DD?#1.7), PowerLegs (R?#31.1)
ML_Femur: Hexa (DD?#1.9), PowerLegs (R?#33.1)
ML_Tibia: Hexa (DD?#1.10), PowerLegs (R?#39.1)
MR_Coxa: Hexa (DD?#1.19), PowerLegs (R?#32.1)
MR_Femur: Hexa (DD?#1.20), PowerLegs (R?#34.1)
MR_Tibia: Hexa (DD?#1.21), PowerLegs (R?#40.1)
RL_Coxa: Hexa (DD?#1.11), PowerLegs (R?#41.1)
RL_Femur: Hexa (DD?#1.12), PowerLegs (R?#43.1)
RL_Tibia: Hexa (DD?#1.14), PowerLegs (R?#49.1)
RR_Coxa: Hexa (DD?#1.15), PowerLegs (R?#42.1)
RR_Femur: Hexa (DD?#1.16), PowerLegs (R?#44.1)
RR_Tibia: Hexa (DD?#1.17), PowerLegs (R?#50.1)